# Altium schematic sheet MicroController.SchDoc: SealHAT - SAML21 Microcontroller
size Letter; PageSetup: Record=PageOptions|CenterHorizontal=True|CenterVertical=True|PrintScale=0.94|XCorrection=1.00|YCorrection=1.00|PrintKind=1|BorderSize=5000000|LeftOffset=0|BottomOffset=0|Orientation=2|PaperLength=1000|PaperWidth=1000|Scale=100|PaperSource=7|PrintQuality=-3|MediaType=1|DitherType=10|PrintScaleMode=1|PaperKind=Letter|PaperIndex=1
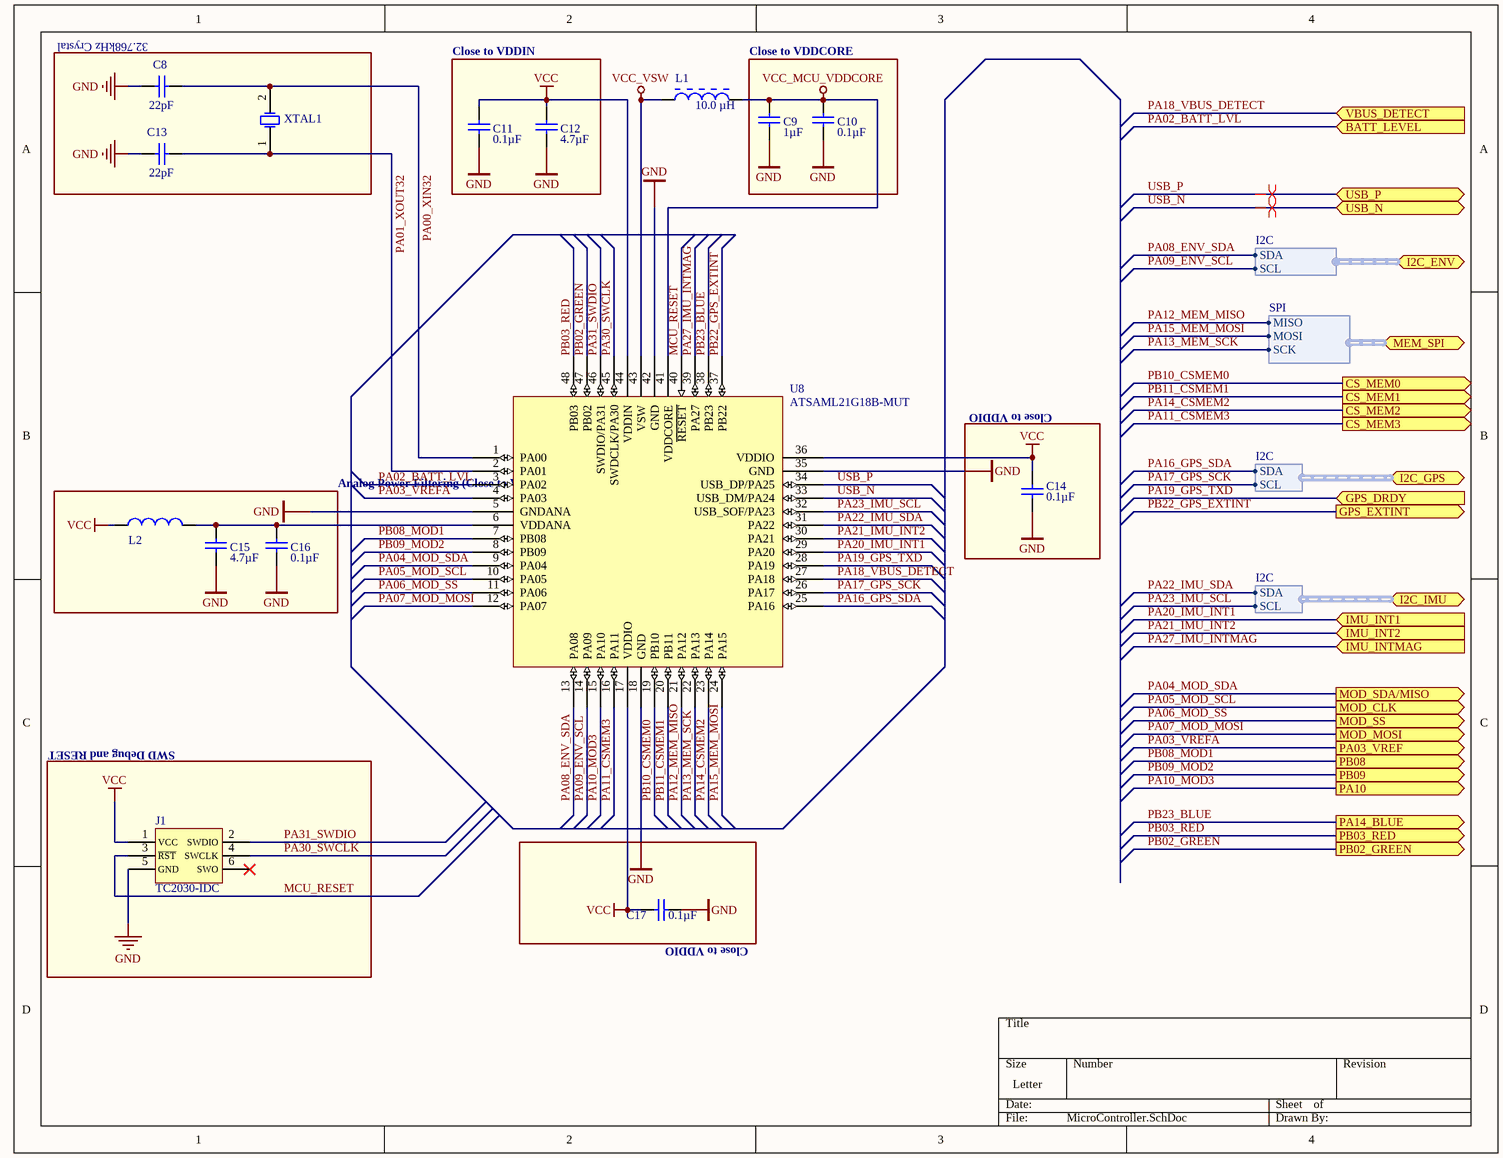
[diagram p0: MicroController.SchDoc]

## Parts
C8  Capacitance: 22pF  [C0402M]  (hidden comment: GRM1555C1H220FA01D)
C9  Capacitance: 1µF  [C0603N]  (hidden comment: CL10B105KP8NFNC)
C10  Capacitance: 0.1µF  [C0603N]  (hidden comment: CL10B104KO8NFNC)
C11  Capacitance: 0.1µF  [C0603N]  (hidden comment: CL10B104KO8NFNC)
C12  Capacitance: 4.7µF  [C0603N]  (hidden comment: C0603C475K8PACTU)
C13  Capacitance: 22pF  [C0402M]  (hidden comment: GRM1555C1H220FA01D)
C14  Capacitance: 0.1µF  [C0603N]  (hidden comment: CL10B104KO8NFNC)
C15  Capacitance: 4.7µF  [C0603N]  (hidden comment: C0603C475K8PACTU)
C16  Capacitance: 0.1µF  [C0603N]  (hidden comment: CL10B104KO8NFNC)
C17  Capacitance: 0.1µF  [C0603N]  (hidden comment: CL10B104KO8NFNC)
J1  TC2030-IDC  [PINHEAD127_1x5]  (no BOM)
L1  Inductance: 10.0 µH  [SRN3015]  (hidden comment: SRN3015-100M)
L2  LI0603G221R-10  [R0603L]  (value not drawn)
U8  ATSAML21G18B-MUT  [QFN50P700X700X90-49N]
XTAL1  FC-135 32.7680KA-A3  [FC-135R$2F$FC-135]  (value not drawn)

## Blocks framed on the sheet
32.768kHz Crystal: C8 C13 XTAL1
Close to VDDIN: C11 C12
Close to VDDCORE: C9 C10
Close to VDDIO: C14
Analog Power Filtering (Close to VDDANA/GNDANA): C15 C16 L2
SWD Debug and RESET: J1
Close to VDDIO: C17

## Ports
BATT_LEVEL (in), CS_MEM0 (out), CS_MEM1 (out), CS_MEM2 (out), CS_MEM3 (out), GPS_DRDY (in), GPS_EXTINT (out), I2C_ENV (harness I2C), I2C_GPS (harness I2C), I2C_IMU (harness I2C), IMU_INT1 (in), IMU_INT2 (in), IMU_INTMAG (in), MEM_SPI (harness SPI), MOD_CLK (out), MOD_MOSI (out), MOD_SDA/MISO (out), MOD_SS (out), PA03_VREF (out), PA10 (out), PA14_BLUE (out), PB02_GREEN (out), PB03_RED (out), PB08 (out), PB09 (out), USB_N (bidir), USB_P (bidir), VBUS_DETECT (in)

## Harnesses
I2C: SDA, SCL
SPI: MOSI, MISO, SCK
I2C: SCL, SDA

## Nets
GND: C8.2 C9.1 C10.2 C11.2 C12.1 C13.2 C14.2 C15.1 C16.2 C17.2 J1.5(GND) U8.5(GNDANA) U8.18(GND) U8.35(GND) U8.42(GND)
VCC: C11.1 C12.2 C14.1 C17.1 J1.1(VCC) L2.1 U8.17(VDDIO) U8.36(VDDIO) U8.44(VDDIN)
VCC_MCU_VDDCORE: C9.2 C10.1 L1.2 U8.41(VDDCORE)
VCC_VSW: L1.1 U8.43(VSW)
MCU_RESET: J1.3(~{RST}) U8.40(~{RESET})
PA00_XIN32: C8.1 U8.1(PA00) XTAL1.2(X2)
PA01_XOUT32: C13.1 U8.2(PA01) XTAL1.1(X1)
PA02_BATT_LVL: U8.3(PA02) ; port BATT_LEVEL
PA03_VREFA: U8.4(PA03) ; port PA03_VREF
PA04_MOD_SDA: U8.9(PA04) ; port MOD_SDA/MISO
PA05_MOD_SCL: U8.10(PA05) ; port MOD_CLK
PA06_MOD_SS: U8.11(PA06) ; port MOD_SS
PA07_MOD_MOSI: U8.12(PA07) ; port MOD_MOSI
PA08_ENV_SDA: U8.13(PA08) ; port I2C_ENV.SDA
PA09_ENV_SCL: U8.14(PA09) ; port I2C_ENV.SCL
PA10_MOD3: U8.15(PA10) ; port PA10
PA11_CSMEM3: U8.16(PA11) ; port CS_MEM3
PA12_MEM_MISO: U8.21(PA12) ; port MEM_SPI.MISO
PA13_MEM_SCK: U8.22(PA13) ; port MEM_SPI.SCK
PA14_CSMEM2: U8.23(PA14) ; port CS_MEM2
PA15_MEM_MOSI: U8.24(PA15) ; port MEM_SPI.MOSI
PA16_GPS_SDA: U8.25(PA16) ; port I2C_GPS.SDA
PA17_GPS_SCK: U8.26(PA17) ; port I2C_GPS.SCL
PA18_VBUS_DETECT: U8.27(PA18) ; port VBUS_DETECT
PA19_GPS_TXD: U8.28(PA19) ; port GPS_DRDY
PA20_IMU_INT1: U8.29(PA20) ; port IMU_INT1
PA21_IMU_INT2: U8.30(PA21) ; port IMU_INT2
PA22_IMU_SDA: U8.31(PA22) ; port I2C_IMU.SDA
PA23_IMU_SCL: U8.32(USB_SOF/PA23) ; port I2C_IMU.SCL
PA27_IMU_INTMAG: U8.39(PA27) ; port IMU_INTMAG
PA30_SWCLK: J1.4(SWCLK) U8.45(SWDCLK/PA30)
PA31_SWDIO: J1.2(SWDIO) U8.46(SWDIO/PA31)
PB02_GREEN: U8.47(PB02) ; port PB02_GREEN
PB03_RED: U8.48(PB03) ; port PB03_RED
PB08_MOD1: U8.7(PB08) ; port PB08
PB09_MOD2: U8.8(PB09) ; port PB09
PB10_CSMEM0: U8.19(PB10) ; port CS_MEM0
PB11_CSMEM1: U8.20(PB11) ; port CS_MEM1
PB22_GPS_EXTINT: U8.37(PB22) ; port GPS_EXTINT
PB23_BLUE: U8.38(PB23) ; port PA14_BLUE
USB_N: U8.33(USB_DM/PA24) ; port USB_N
USB_P: U8.34(USB_DP/PA25) ; port USB_P
NetC15_2: C15.2 C16.1 L2.2 U8.6(VDDANA)

Not connected (* = marked no-connect by the designer): J1 6(SWO)*

## Layout directives
differential pair: USB_N, USB_P

## Library data of the parts
C8 C13 = CAPACITOR_NP: CAP CER 22PF 50V C0G/NP0 0402; HOUSEPART: NO; POPULATE: 1; TOLERANCE: ±1%; Temperature Coefficient: X5R; DeviceName: GRM1555C1H220FA01D; LibraryName: MF_Passives; DeviceSetName: CAPACITOR_NP; MPN: GRM1555C1H220FA01D; URL: https://octopart.com/grm1555c1h220fa01d-murata-21524193; VOLTAGE: 50V; MF_PARTNUM: GRM1555C1H220FA01D
C9 = CAPACITOR_NP: CAP CER 1UF 10V X7R 0603; HOUSEPART: NO; POPULATE: 1; TOLERANCE: ±10%; VOLTAGE: 16V; DeviceName: CL10B105KP8NFNC; LibraryName: MF_Passives; DeviceSetName: CAPACITOR_NP; MPN: CL10B105KP8NFNC; URL: https://octopart.com/cl10b104ko8nfnc-samsung-19831587; MF_PARTNUM: CL10B105KP8NFNC; Temperature Coefficient: X7R
C10 C11 C14 C16 C17 = CAPACITOR_NP: HOUSEPART: NO; POPULATE: 1; TOLERANCE: ±10%; VOLTAGE: 16V; Temperature Coefficient: X7R; DeviceName: CL10B104KO8NFNC; LibraryName: MF_Passives; DeviceSetName: CAPACITOR_NP; MPN: CL10B104KO8NFNC; URL: https://octopart.com/cl10b104ko8nfnc-samsung-19831587; MF_PARTNUM: CL10B104KO8NFNC
C12 C15 = CAPACITOR_NP: CAP CER 1UF 10V X7R 0603; HOUSEPART: NO; POPULATE: 1; TOLERANCE: ±10%; Temperature Coefficient: X5R; DeviceName: C0603C475K8PACTU; LibraryName: MF_Passives; DeviceSetName: CAPACITOR_NP; MPN: C0603C475K8PACTU; URL: https://octopart.com/c0603c475k8pactu-kemet-9145152; VOLTAGE: 10V; MF_PARTNUM: C0603C475K8PACTU
J1 = TC2030-IDC-NL: CABLE ADAPTER 6 POS; Manufacturer: Tag-Connect LLC; Manufacturer Part Number: TC2030-IDC; hyperlink: https://www.digikey.com/product-detail/en/tag-connect-llc/TC2030-IDC/TC2030-IDC-ND/4571121
L1 = CMP-911278-2: Semi-shielded Power Inductor, 10 uH, +/- 20%, 1 A, -40 to 125 degC, 3 x 3 x 1.5 mm SMD, RoHS and Halogen Free, Tape and Reel; Self Resonant Frequency: 45000000.0 Hz; Number of Pins: 2; Octopart Url: https://octopart.com/srn3015-100m-bourns-20579191; OctopartID: 45668d5663779aa1; Packaging: Tape & Reel (TR); REACH SVHC Compliance: No SVHC; RoHS: Compliant; Manufacturer Part Number: SRN3015-100M
L2 = INDUCTOR: HOUSEPART: NO; POPULATE: 1; LibraryName: MF_Passives; DeviceSetName: INDUCTOR; MPN: LI0603G221R-10; URL: https://www.digikey.com/product-detail/en/laird-signal-integrity-products/LI0603G221R-10/240-2368-1-ND/806728
U8 = ATSAML21G18B-MUT: RAM Memory Size: 32768 B; Octopart URL: https://octopart.com/atsaml21g18b-mut-microchip-77761695; RoHS: Compliant; OctopartID: 3cd3f17b952ae314; Manufacturer Part Number: ATSAML21G18B-MUT
XTAL1 = FC-13532.7680KA-A3: FC-135 Series 32.768 KHz ±20 ppm 12.5 pF -40 to +85°C Surface Mount Crystal; manufacturer: epson; Octopart URL: https://octopart.com/fc-135+32.7680ka-a3-epson-39545807; Manufacturer Part Number: FC-135 32.7680KA-A3; Case/Package: FC-135